# Altium schematic sheet [01] - CoverSheet.SchDoc
size A3; Engineer: Derryn Harvie; Revision: 0.1; SheetNumber: 1
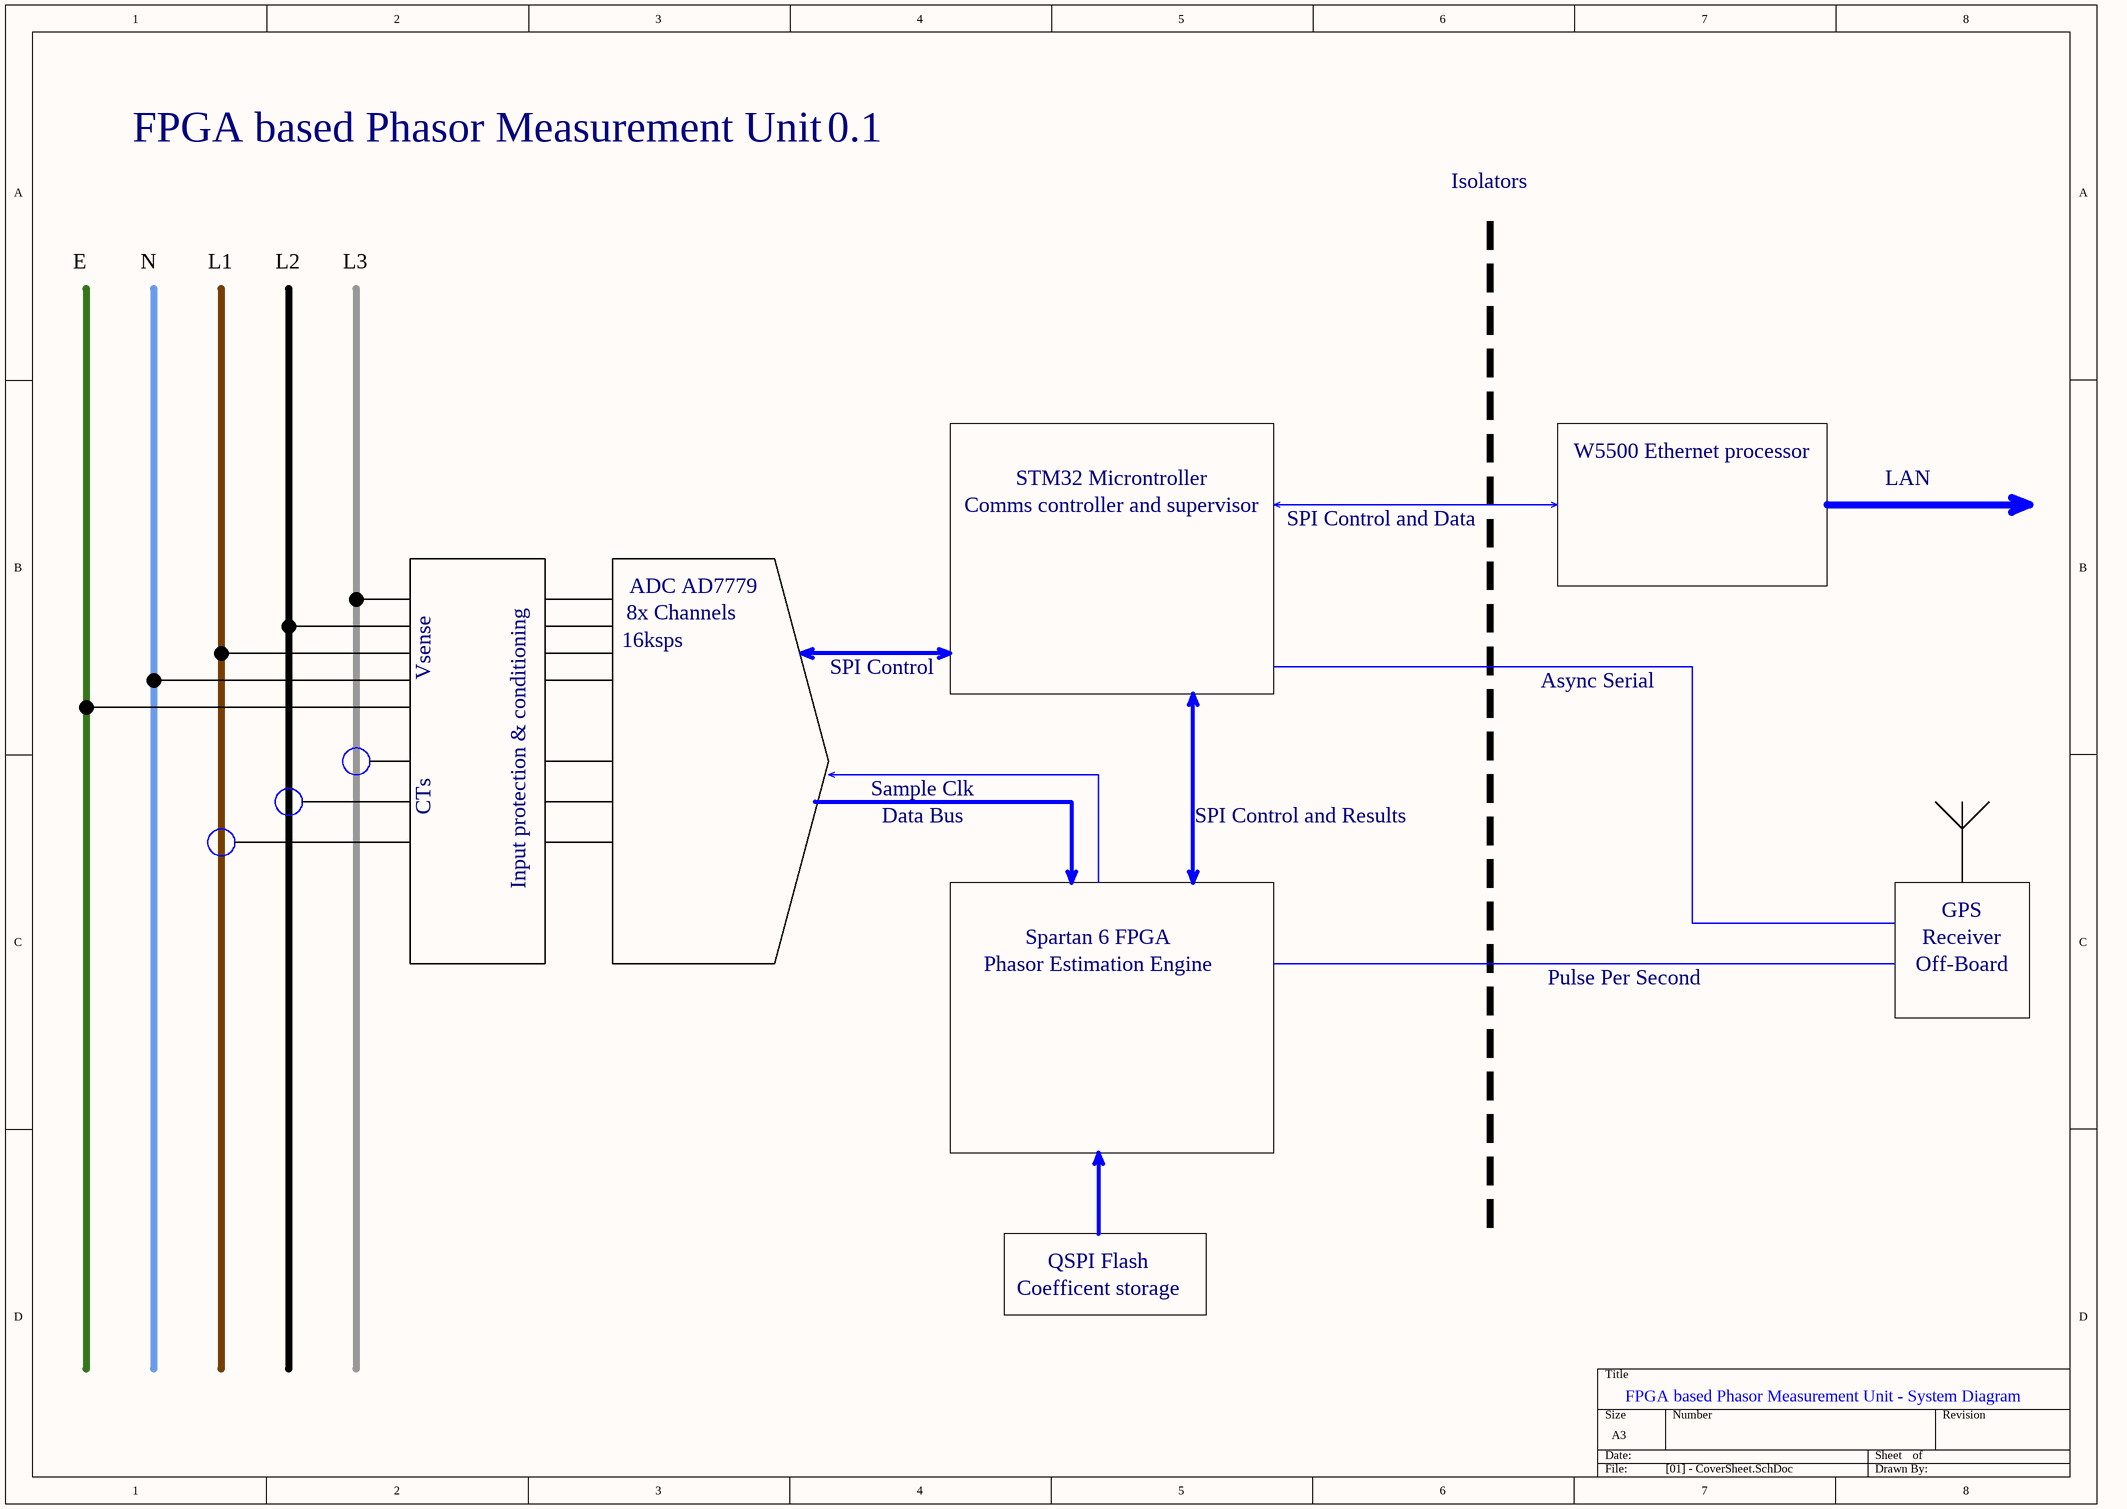
[diagram p0: [01] - CoverSheet.SchDoc]

## Notes on the sheet
- FPGA based Phasor Measurement Unit
- Isolators
- E
- N
- L1
- L2
- L3
- W5500 Ethernet processor
- STM32 Microntroller
- Comms controller and supervisor
- SPI Control and Data
- LAN
- ADC AD7779
- 8x Channels
- 16ksps
- Vsense
- SPI Control
- Async Serial
- Input protection & conditioning
- Sample Clk
- CTs
- Data Bus
- SPI Control and Results
- GPS
- Spartan 6 FPGA
- Phasor Estimation Engine
- Pulse Per Second
- Receiver
- Off-Board
- QSPI Flash
- Coefficent storage
- FPGA based Phasor Measurement Unit - System Diagram